# Altium schematic sheet FPGA_14_15.SchDoc: SPEC-A7
size 420 x 297 mm; Author: G.Kasprowicz; CompanyName: WUT ISE; DrawnBy: G.Kasprowicz; Organization: WUT ISE; Address1: PW ISE; Address2: Nowowiejska 15/19 00-665 Warsaw; Address3: gkasprow@gmail.com; Revision: 2; SheetNumber: 3; SheetTotal: 18; ModifiedBy: -; CheckedDate: -; Title2: FPGA 14 &15; DivGrp: WUT ISE; Designer: G.Kasprowicz; ModifiedDate: -; ProjectName: Sensor Box
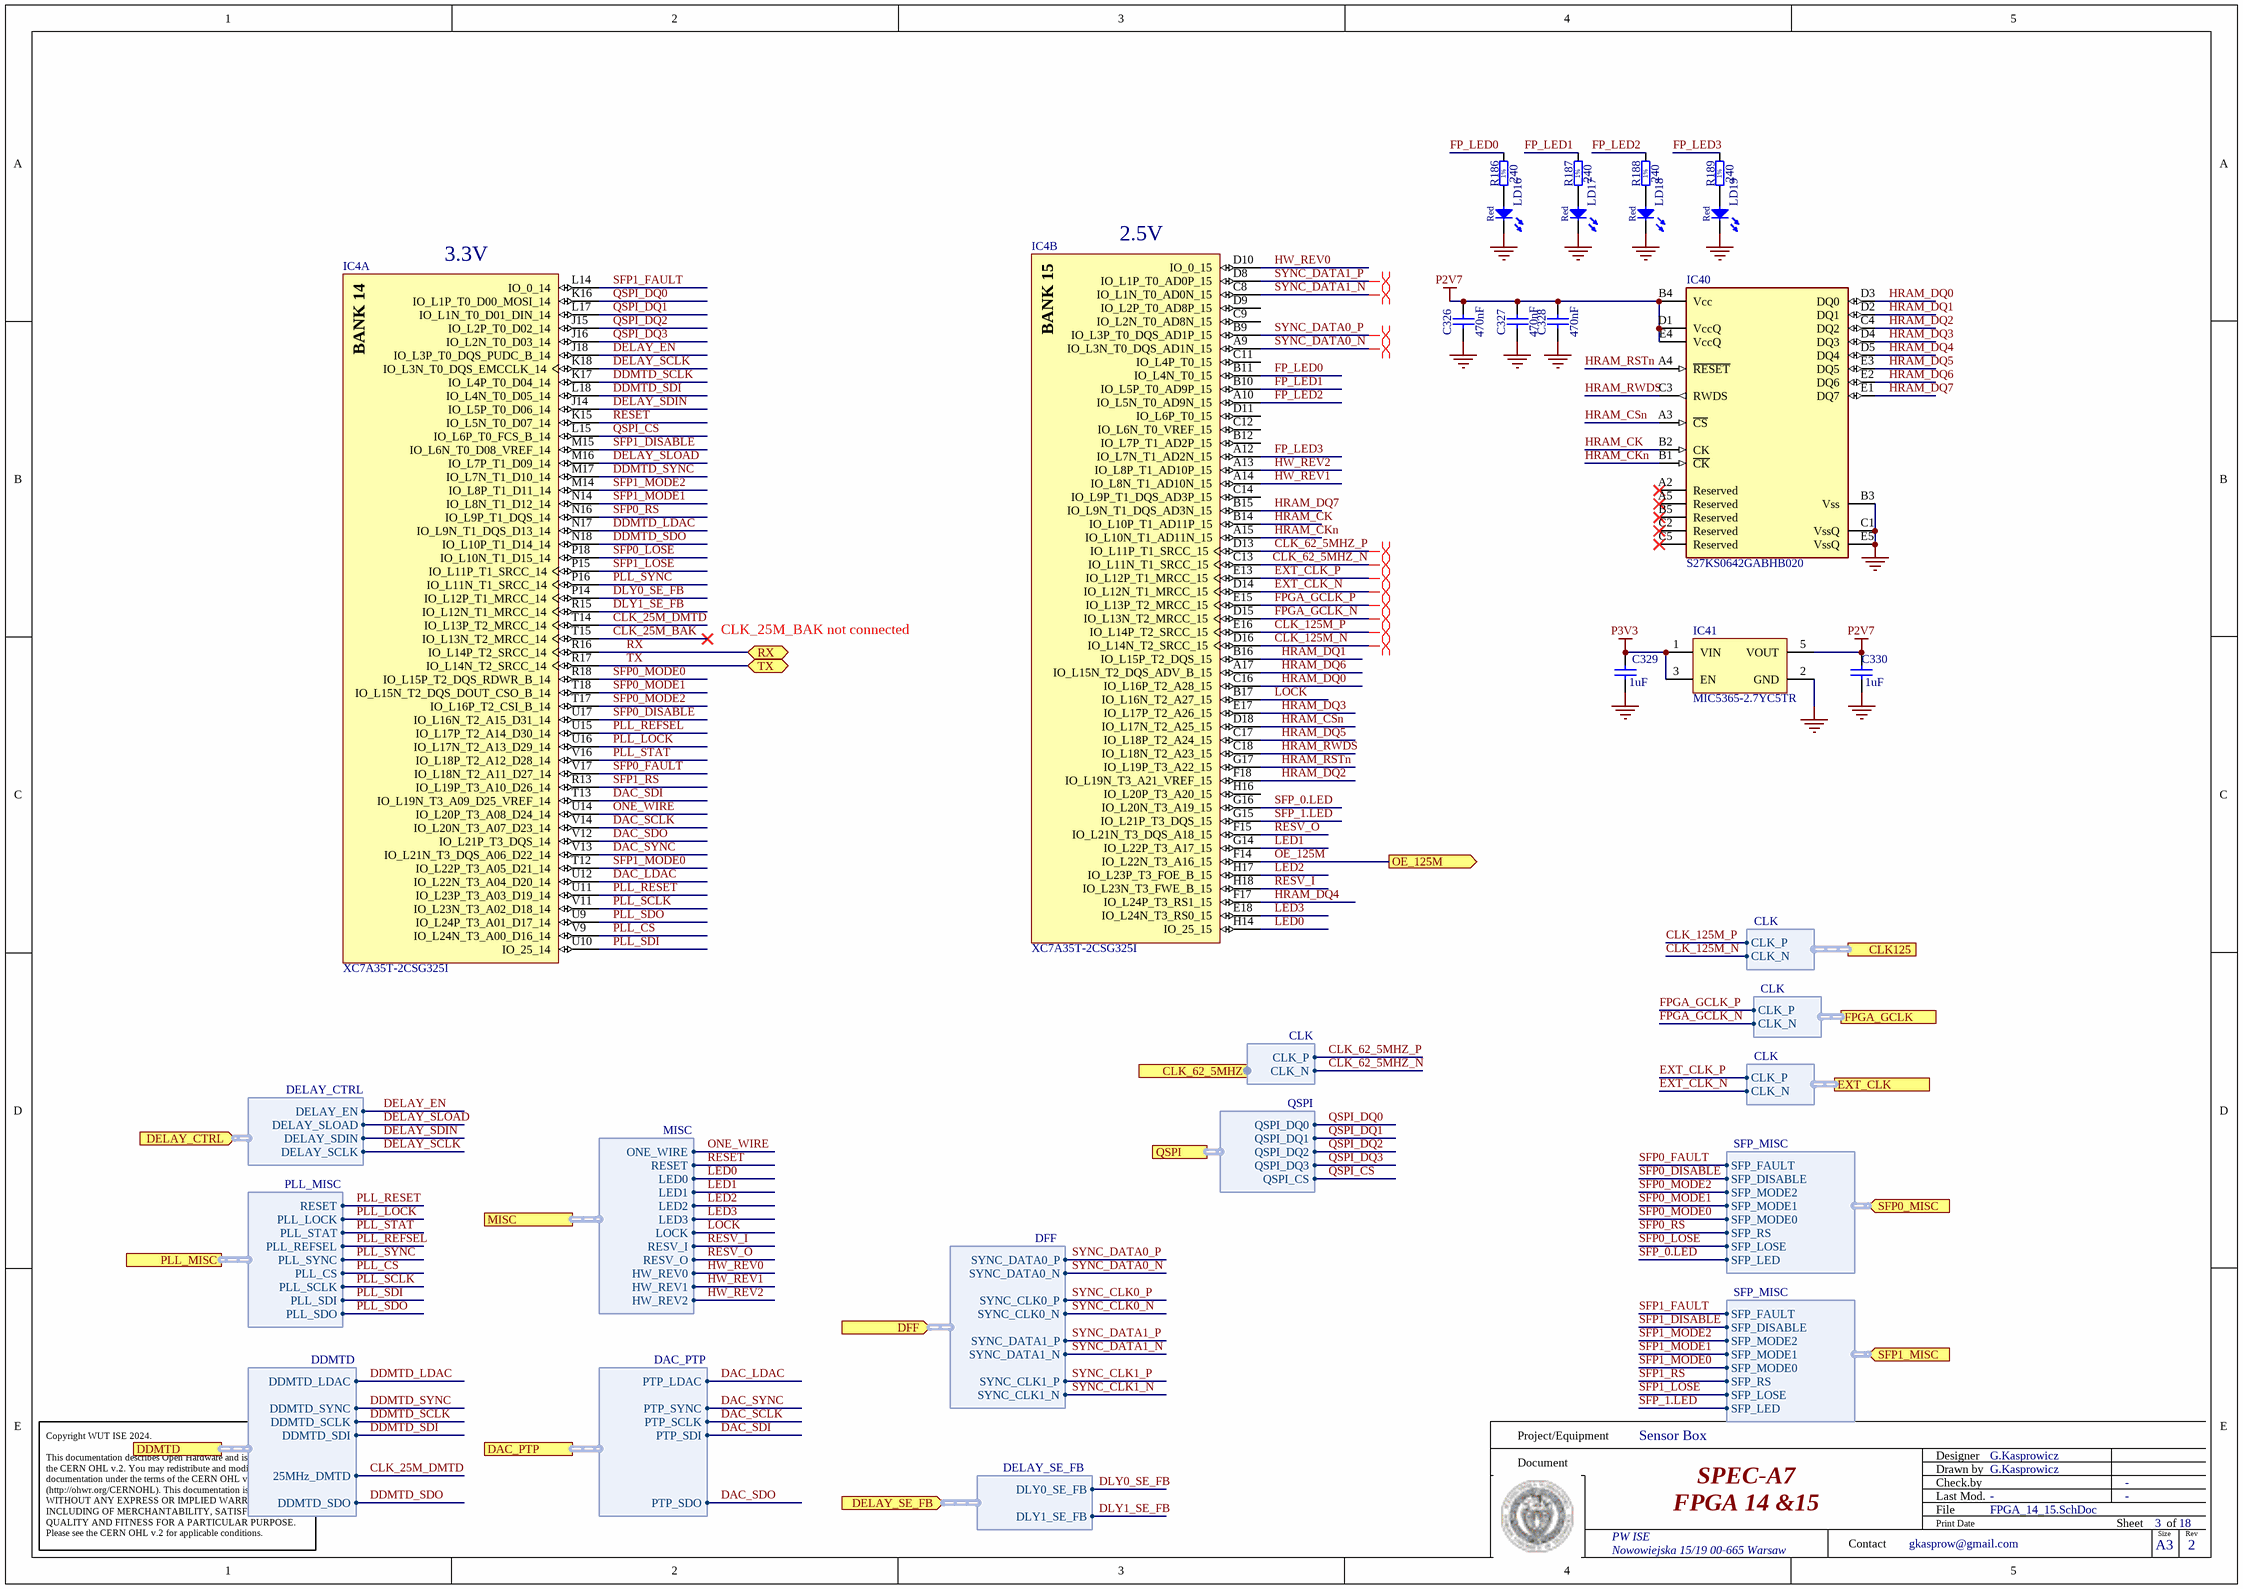
[diagram p0: FPGA_14_15.SchDoc]

## Parts
C326  470nF  [CAPC0603X33N]
C327  470nF  [CAPC0603X33N]
C328  470nF  [CAPC0603X33N]
C329  1uF  [CAPC1005X55N]
C330  1uF  [CAPC1005X55N]
IC4  XC7A35T-2CSG325I  [CSG325]  (parts A,B of 9)
IC40  S27KS0642GABHB020  [FP-PG-BGA-24-IPC_A]
IC41  MIC5365-2.7YC5TR  [SOT65P210X110-5N]
LD16  Red  [LED_AVAGO_HSMC-C120]
LD17  Red  [LED_AVAGO_HSMC-C120]
LD18  Red  [LED_AVAGO_HSMC-C120]
LD19  Red  [LED_AVAGO_HSMC-C120]
R186  240  [RESC1005X40N]
R187  240  [RESC1005X40N]
R188  240  [RESC1005X40N]
R189  240  [RESC1005X40N]

## Ports
CLK125 (harness CLK, see SPEC-A7-TOP[3C], FPGA_MGT[2C]), CLK_62_5MHZ (harness CLK, see SPEC-A7-TOP[3B], Clocks_PLL[5B]), DAC_PTP (harness DAC_PTP, see SPEC-A7-TOP[3C], VCXO_25M_PTP[1C]), DDMTD (harness DDMTD, see SPEC-A7-TOP[3C], VCXO_25M_DDMTD[1D]), DELAY_CTRL (in, harness DELAY_CTRL, see SPEC-A7-TOP[3C], DIFF_DELAY_FANOUT[5B]), DELAY_SE_FB (in, harness DELAY_SE_FB, see SPEC-A7-TOP[3C], DIFF_DELAY_FANOUT[5D]), DFF (in, harness DFF, see SPEC-A7-TOP[3C], Clocks_PLL[3C], DIFF_DELAY_FANOUT[5C]), EXT_CLK (harness CLK, see SPEC-A7-TOP[3B], Clocks_PLL[3B]), FPGA_GCLK (harness CLK, see SPEC-A7-TOP[3B], Clocks_PLL[3B]), MISC (harness MISC, see SPEC-A7-TOP[3C], Misc[2C]), OE_125M (out, see SPEC-A7-TOP[3C], XO_125M[1D]), PLL_MISC (harness PLL_MISC, see SPEC-A7-TOP[3B], Clocks_PLL[5D]), QSPI (harness QSPI, see SPEC-A7-TOP[3C], FPGA_PWR_CONFIG[3E]), RX (bidir, see SPEC-A7-TOP[3C]), SFP0_MISC (in, harness SFP_MISC, see SPEC-A7-TOP[3B], SFP[4B]), SFP1_MISC (in, harness SFP_MISC, see SPEC-A7-TOP[3B], SFP[4C]), TX (bidir, see SPEC-A7-TOP[3C])

## Harnesses
DDMTD: DDMTD_LDAC, DDMTD_SYNC, DDMTD_SCLK, DDMTD_SDI, DDMTD_SDO, 25MHz_DMTD
DAC_PTP: PTP_LDAC, PTP_SYNC, PTP_SCLK, PTP_SDI, PTP_SDO
PLL_MISC: RESET, PLL_LOCK, PLL_STAT, PLL_REFSEL, PLL_SYNC, PLL_CS, PLL_SCLK, PLL_SDI, PLL_SDO
DELAY_CTRL: DELAY_EN, DELAY_SLOAD, DELAY_SDIN, DELAY_SCLK
DFF: SYNC_DATA0_P, SYNC_DATA0_N, SYNC_CLK0_P, SYNC_CLK0_N, SYNC_DATA1_P, SYNC_DATA1_N, SYNC_CLK1_P, SYNC_CLK1_N
DELAY_SE_FB: DLY0_SE_FB, DLY1_SE_FB
MISC: ONE_WIRE, RESET, LED0, LED1, LED2, LED3, LOCK, RESV_I, RESV_O, HW_REV0, HW_REV1, HW_REV2
QSPI: QSPI_DQ0, QSPI_DQ1, QSPI_DQ2, QSPI_DQ3, QSPI_CS
CLK: CLK_P, CLK_N
SFP_MISC: SFP_FAULT, SFP_DISABLE, SFP_MODE2, SFP_MODE1, SFP_MODE0, SFP_RS, SFP_LOSE, SFP_LED

## Nets
GND: C326.1 C327.1 C328.1 C329.1 C330.1 IC40.B3(Vss) IC40.C1(VssQ) IC40.E5(VssQ) IC41.2(GND) LD16.1(C) LD17.1(C) LD18.1(C) LD19.1(C)
P2V7: C326.2 C327.2 C328.2 C330.2 IC40.B4(Vcc) IC40.D1(VccQ) IC40.E4(VccQ) IC41.5(VOUT)
P3V3: C329.2 IC41.1(VIN) IC41.3(EN)
CLK_25M_BAK: IC4.T15(IO_L13N_T2_MRCC_14)
CLK_25M_DMTD: IC4.T14(IO_L13P_T2_MRCC_14) ; port DDMTD.25MHz_DMTD
CLK_62_5MHZ_N: IC4.C13(IO_L11N_T1_SRCC_15) ; port CLK_62_5MHZ.CLK_N
CLK_62_5MHZ_P: IC4.D13(IO_L11P_T1_SRCC_15) ; port CLK_62_5MHZ.CLK_P
CLK_125M_N: IC4.D16(IO_L14N_T2_SRCC_15) ; port CLK125.CLK_N
CLK_125M_P: IC4.E16(IO_L14P_T2_SRCC_15) ; port CLK125.CLK_P
DAC_LDAC: IC4.U12(IO_L22N_T3_A04_D20_14) ; port DAC_PTP.PTP_LDAC
DAC_SCLK: IC4.V14(IO_L20N_T3_A07_D23_14) ; port DAC_PTP.PTP_SCLK
DAC_SDI: IC4.T13(IO_L19N_T3_A09_D25_VREF_14) ; port DAC_PTP.PTP_SDI
DAC_SDO: IC4.V12(IO_L21P_T3_DQS_14) ; port DAC_PTP.PTP_SDO
DAC_SYNC: IC4.V13(IO_L21N_T3_DQS_A06_D22_14) ; port DAC_PTP.PTP_SYNC
DDMTD_LDAC: IC4.N17(IO_L9N_T1_DQS_D13_14) ; port DDMTD.DDMTD_LDAC
DDMTD_SCLK: IC4.K17(IO_L4P_T0_D04_14) ; port DDMTD.DDMTD_SCLK
DDMTD_SDI: IC4.L18(IO_L4N_T0_D05_14) ; port DDMTD.DDMTD_SDI
DDMTD_SDO: IC4.N18(IO_L10P_T1_D14_14) ; port DDMTD.DDMTD_SDO
DDMTD_SYNC: IC4.M17(IO_L7N_T1_D10_14) ; port DDMTD.DDMTD_SYNC
DELAY_EN: IC4.J18(IO_L3P_T0_DQS_PUDC_B_14) ; port DELAY_CTRL.DELAY_EN
DELAY_SCLK: IC4.K18(IO_L3N_T0_DQS_EMCCLK_14) ; port DELAY_CTRL.DELAY_SCLK
DELAY_SDIN: IC4.J14(IO_L5P_T0_D06_14) ; port DELAY_CTRL.DELAY_SDIN
DELAY_SLOAD: IC4.M16(IO_L7P_T1_D09_14) ; port DELAY_CTRL.DELAY_SLOAD
DLY0_SE_FB: IC4.P14(IO_L12P_T1_MRCC_14) ; port DELAY_SE_FB.DLY0_SE_FB
DLY1_SE_FB: IC4.R15(IO_L12N_T1_MRCC_14) ; port DELAY_SE_FB.DLY1_SE_FB
EXT_CLK_N: IC4.D14(IO_L12N_T1_MRCC_15) ; port EXT_CLK.CLK_N
EXT_CLK_P: IC4.E13(IO_L12P_T1_MRCC_15) ; port EXT_CLK.CLK_P
FP_LED0: IC4.B11(IO_L4N_T0_15) R186.2
FP_LED1: IC4.B10(IO_L5P_T0_AD9P_15) R187.2
FP_LED2: IC4.A10(IO_L5N_T0_AD9N_15) R188.2
FP_LED3: IC4.A12(IO_L7N_T1_AD2N_15) R189.2
FPGA_GCLK_N: IC4.D15(IO_L13N_T2_MRCC_15) ; port FPGA_GCLK.CLK_N
FPGA_GCLK_P: IC4.E15(IO_L13P_T2_MRCC_15) ; port FPGA_GCLK.CLK_P
HRAM_CK: IC4.B14(IO_L10P_T1_AD11P_15) IC40.B2(CK)
HRAM_CKn: IC4.A15(IO_L10N_T1_AD11N_15) IC40.B1(~{CK})
HRAM_CSn: IC4.D18(IO_L17N_T2_A25_15) IC40.A3(~{CS})
HRAM_DQ0: IC4.C16(IO_L16P_T2_A28_15) IC40.D3(DQ0)
HRAM_DQ1: IC4.B16(IO_L15P_T2_DQS_15) IC40.D2(DQ1)
HRAM_DQ2: IC4.F18(IO_L19N_T3_A21_VREF_15) IC40.C4(DQ2)
HRAM_DQ3: IC4.E17(IO_L17P_T2_A26_15) IC40.D4(DQ3)
HRAM_DQ4: IC4.F17(IO_L24P_T3_RS1_15) IC40.D5(DQ4)
HRAM_DQ5: IC4.C17(IO_L18P_T2_A24_15) IC40.E3(DQ5)
HRAM_DQ6: IC4.A17(IO_L15N_T2_DQS_ADV_B_15) IC40.E2(DQ6)
HRAM_DQ7: IC4.B15(IO_L9N_T1_DQS_AD3N_15) IC40.E1(DQ7)
HRAM_RSTn: IC4.G17(IO_L19P_T3_A22_15) IC40.A4(~{RESET})
HRAM_RWDS: IC4.C18(IO_L18N_T2_A23_15) IC40.C3(RWDS)
HW_REV0: IC4.D10(IO_0_15) ; port MISC.HW_REV0
HW_REV1: IC4.A14(IO_L8N_T1_AD10N_15) ; port MISC.HW_REV1
HW_REV2: IC4.A13(IO_L8P_T1_AD10P_15) ; port MISC.HW_REV2
LED0: IC4.H14(IO_25_15) ; port MISC.LED0
LED1: IC4.G14(IO_L22P_T3_A17_15) ; port MISC.LED1
LED2: IC4.H17(IO_L23P_T3_FOE_B_15) ; port MISC.LED2
LED3: IC4.E18(IO_L24N_T3_RS0_15) ; port MISC.LED3
LOCK: IC4.B17(IO_L16N_T2_A27_15) ; port MISC.LOCK
OE_125M: IC4.F14(IO_L22N_T3_A16_15) ; port OE_125M
ONE_WIRE: IC4.U14(IO_L20P_T3_A08_D24_14) ; port MISC.ONE_WIRE
PLL_CS: IC4.V9(IO_L24N_T3_A00_D16_14) ; port PLL_MISC.PLL_CS
PLL_LOCK: IC4.U16(IO_L17N_T2_A13_D29_14) ; port PLL_MISC.PLL_LOCK
PLL_REFSEL: IC4.U15(IO_L17P_T2_A14_D30_14) ; port PLL_MISC.PLL_REFSEL
PLL_RESET: IC4.U11(IO_L23P_T3_A03_D19_14) ; port PLL_MISC.RESET
PLL_SCLK: IC4.V11(IO_L23N_T3_A02_D18_14) ; port PLL_MISC.PLL_SCLK
PLL_SDI: IC4.U10(IO_25_14) ; port PLL_MISC.PLL_SDI
PLL_SDO: IC4.U9(IO_L24P_T3_A01_D17_14) ; port PLL_MISC.PLL_SDO
PLL_STAT: IC4.V16(IO_L18P_T2_A12_D28_14) ; port PLL_MISC.PLL_STAT
PLL_SYNC: IC4.P16(IO_L11N_T1_SRCC_14) ; port PLL_MISC.PLL_SYNC
QSPI_CS: IC4.L15(IO_L6P_T0_FCS_B_14) ; port QSPI.QSPI_CS
QSPI_DQ0: IC4.K16(IO_L1P_T0_D00_MOSI_14) ; port QSPI.QSPI_DQ0
QSPI_DQ1: IC4.L17(IO_L1N_T0_D01_DIN_14) ; port QSPI.QSPI_DQ1
QSPI_DQ2: IC4.J15(IO_L2P_T0_D02_14) ; port QSPI.QSPI_DQ2
QSPI_DQ3: IC4.J16(IO_L2N_T0_D03_14) ; port QSPI.QSPI_DQ3
RESET: IC4.K15(IO_L5N_T0_D07_14) ; port MISC.RESET
RESV_I: IC4.H18(IO_L23N_T3_FWE_B_15) ; port MISC.RESV_I
RESV_O: IC4.F15(IO_L21N_T3_DQS_A18_15) ; port MISC.RESV_O
RX: IC4.R16(IO_L14P_T2_SRCC_14) ; port RX
SFP0_DISABLE: IC4.U17(IO_L16N_T2_A15_D31_14) ; port SFP0_MISC.SFP_DISABLE
SFP0_FAULT: IC4.V17(IO_L18N_T2_A11_D27_14) ; port SFP0_MISC.SFP_FAULT
SFP0_LOSE: IC4.P18(IO_L10N_T1_D15_14) ; port SFP0_MISC.SFP_LOSE
SFP0_MODE0: IC4.R18(IO_L15P_T2_DQS_RDWR_B_14) ; port SFP0_MISC.SFP_MODE0
SFP0_MODE1: IC4.T18(IO_L15N_T2_DQS_DOUT_CSO_B_14) ; port SFP0_MISC.SFP_MODE1
SFP0_MODE2: IC4.T17(IO_L16P_T2_CSI_B_14) ; port SFP0_MISC.SFP_MODE2
SFP0_RS: IC4.N16(IO_L9P_T1_DQS_14) ; port SFP0_MISC.SFP_RS
SFP1_DISABLE: IC4.M15(IO_L6N_T0_D08_VREF_14) ; port SFP1_MISC.SFP_DISABLE
SFP1_FAULT: IC4.L14(IO_0_14) ; port SFP1_MISC.SFP_FAULT
SFP1_LOSE: IC4.P15(IO_L11P_T1_SRCC_14) ; port SFP1_MISC.SFP_LOSE
SFP1_MODE0: IC4.T12(IO_L22P_T3_A05_D21_14) ; port SFP1_MISC.SFP_MODE0
SFP1_MODE1: IC4.N14(IO_L8N_T1_D12_14) ; port SFP1_MISC.SFP_MODE1
SFP1_MODE2: IC4.M14(IO_L8P_T1_D11_14) ; port SFP1_MISC.SFP_MODE2
SFP1_RS: IC4.R13(IO_L19P_T3_A10_D26_14) ; port SFP1_MISC.SFP_RS
SFP_0.LED: IC4.G16(IO_L20N_T3_A19_15) ; port SFP0_MISC.SFP_LED
SFP_1.LED: IC4.G15(IO_L21P_T3_DQS_15) ; port SFP1_MISC.SFP_LED
SYNC_CLK0_N: port DFF.SYNC_CLK0_N
SYNC_CLK0_P: port DFF.SYNC_CLK0_P
SYNC_CLK1_N: port DFF.SYNC_CLK1_N
SYNC_CLK1_P: port DFF.SYNC_CLK1_P
SYNC_DATA0_N: IC4.A9(IO_L3N_T0_DQS_AD1N_15) ; port DFF.SYNC_DATA0_N
SYNC_DATA0_P: IC4.B9(IO_L3P_T0_DQS_AD1P_15) ; port DFF.SYNC_DATA0_P
SYNC_DATA1_N: IC4.C8(IO_L1N_T0_AD0N_15) ; port DFF.SYNC_DATA1_N
SYNC_DATA1_P: IC4.D8(IO_L1P_T0_AD0P_15) ; port DFF.SYNC_DATA1_P
TX: IC4.R17(IO_L14N_T2_SRCC_14) ; port TX
NetLD16_2: LD16.2(A) R186.1
NetLD17_2: LD17.2(A) R187.1
NetLD18_2: LD18.2(A) R188.1
NetLD19_2: LD19.2(A) R189.1

Not connected (* = marked no-connect by the designer): IC4 B12(IO_L7P_T1_AD2P_15) C9(IO_L2N_T0_AD8N_15) C11(IO_L4P_T0_15) C12(IO_L6N_T0_VREF_15) C14(IO_L9P_T1_DQS_AD3P_15) D9(IO_L2P_T0_AD8P_15) D11(IO_L6P_T0_15) H16(IO_L20P_T3_A20_15); IC40 A2(Reserved)* A5(Reserved)* B5(Reserved)* C2(Reserved)* C5(Reserved)*

## Layout directives
differential pair: CLK_62_5MHZ_N, CLK_62_5MHZ_P, CLK_125M_N, CLK_125M_P, EXT_CLK_N, EXT_CLK_P, FPGA_GCLK_N, FPGA_GCLK_P, SYNC_DATA0_N, SYNC_DATA0_P, SYNC_DATA1_N, SYNC_DATA1_P

## Notes on the sheet
- 3.3V
- 2.5V
- CLK_25M_BAK not connected
- Project/Equipment
- Document
- Designer
- Drawn by
- Check.by
- Copyright WUT ISE 2024.
  This documentation describes Open Hardware and is licensed under the CERN OHL v.2. You may redistribute and modify this documentation under the terms of the CERN OHL v.2. (http://ohwr.org/CERNOHL). This documentation is distributed WITHOUT ANY EXPRESS OR IMPLIED WARRANTY, INCLUDING OF MERCHANTABILITY, SATISFACTORY QUALITY AND FITNESS FOR A PARTICULAR PURPOSE. Please see the CERN OHL v.2 for applicable conditions.
- Contact
- File
- Last Mod.
- Print Date
- Sheet
- Size
- A3
- of
- Rev
- (in symbol CMP-0383-00003-1, part A) BANK 14
- (in symbol CMP-0383-00003-1, part B) BANK 15
- (in symbol R0402_240R_1%_0.0625W_100PPM) 1%

## Library data of the parts
C326-C328 = CC0201_470NF_4V_20%_X5R: Non-polarised capacitor; Part Description: SMD Multilayer Chip Ceramic Capacitor; Manufacturer: GENERIC; Manufacturer1 Part Number: AMK063BJ474MP-F; Voltage: 4V; TC: X5R; Tolerance: ±20%; Part Number: CC0201_470NF_4V_20%_X5R; Component Kind: Standard; Component Type: Standard; Pin Count: 2; Value: 470nF; Status: Not Recommended; Manufacturer Part Number: CC0201_470NF_4V_20%_X5R; Case: 0201; Mounted: Yes; Socket: No; SMD: Yes; Sense: No; Manufacturer1 Example: TAIYO YUDEN; Manufacturer1 ComponentHeight: 0.33mm; HelpURL: \\cern.ch\dfs\Applications\Altium\Datasheets\CC0201_X5R_TAIYO-YUDEN_STANDARD-CLASS2.pdf; Author: CERN DEM JLC; CreateDate: 27.05.2010; LatestRevisionDate: 27.05.2010
C329 C330 = CC0402_1UF_16V_10%_X5R: Non-polarised capacitor; Part Description: SMD Multilayer Chip Ceramic Capacitor; Manufacturer: GENERIC; Manufacturer1 Part Number: C1005X5R1C105KT; Voltage: 16V; TC: X5R; Tolerance: ±10%; Part Number: CC0402_1UF_16V_10%_X5R; Component Kind: Standard; Component Type: Standard; Pin Count: 2; Value: 1uF; Status: Preferred; Manufacturer Part Number: CC0402_1UF_16V_10%_X5R; Case: 0402; Mounted: Yes; Socket: No; SMD: Yes; Sense: No; Manufacturer1 Example: TDK; Manufacturer1 ComponentHeight: 0.55mm; HelpURL: \\cern.ch\dfs\Applications\Altium\Datasheets\CC0402_X5R_TDK_C.pdf; Author: CERN DEM JLC; CreateDate: 25.10.2012; LatestRevisionDate: 25.10.2012
IC4 = CMP-0383-00003-1: Artix-7 FPGA, 150 User I/Os, 4 GTP, 324-Ball BGA, Speed Grade 2, Industrial Grade, Pb-Free; Manufacturer: Xilinx; Available User I/O: 150; Speed Grades: 2; GTP: 4; Logic Cells: 33280; Total Block RAM: 1800 Kb; CMTs: 5; ComponentLink3URL: http://www.xilinx.com/support/documentation/user_guides/ug475_7Series_Pkg_Pinout.pdf; Maximum Distributed RAM: 400 Kb; Operating Temperature Range: Industrial; ComponentLink1URL: http://www.xilinx.com/; Mounting Technology: Surface Mount; ComponentLink1Description: Manufacturer URL; ComponentLink2Description: Datasheet; PartNumber: XC7A35T-2CSG325I; PackageVersion: Rev. 1.11; PackageDescription: 324-Ball Wire-Bond Chip-Scale BGA, Body 15 x 15 mm, Pitch 0.8 mm; DatasheetVersion: Rev. 1.15; PackageReference: CSG-325; ComponentLink3Description: Pinout; ComponentLink4Description: Package Specification; ComponentLink2URL: http://www.xilinx.com/support/documentation/data_sheets/ds180_7Series_Overview.pdf; ComponentLink4URL: http://www.xilinx.com/support/documentation/user_guides/ug475_7Series_Pkg_Pinout.pdf
IC40 = CMP-32844-000028-1: IC PSRAM 64MBIT HYPERBUS 24FBGA
LD16-LD19 = LED_AVAGO_HSMC-C120: LED Red 1C 2A; Part Description: High Performance Right Angle Chip Red LED; Manufacturer: AVAGO TECHNOLOGIES; PressFit: No; Bonding: No; Part Number: LED_AVAGO_HSMC-C120; Component Kind: Standard; Component Type: Standard; Color: Red; PackageDescription: Red Chip LED, 2-Leads, Body 1.7x1.1mm, Side Emitting Package; Manufacturer Part Number: HSMC-C120; Pin Count: 2; Mounted: Yes; Socket: No; SMD: Yes; Sense: No; ComponentHeight: 0.7mm; HelpURL: \\cern.ch\dfs\Applications\Altium\Datasheets\LED_AVAGO_HSMC-C120.pdf; ComponentLink1URL: \\cern.ch\dfs\Applications\Altium\Datasheets\LED_AVAGO_HSMC-C120_DESIGN-GUIDE.pdf; ComponentLink1Description: Design Guide; Author: CERN DEM JMW; CreateDate: 22.07.2009; LatestRevisionDate: 20.06.2012
R186-R189 = R0402_240R_1%_0.0625W_100PPM: Resistor - 1%; Part Description: General Purpose Thick Film Chip Resistor; Manufacturer: GENERIC; Manufacturer1 Part Number: 232270672401L; TC: ±100ppm/°C; PressFit: No; Part Number: R0402_240R_1%_0.0625W_100PPM; Component Kind: Standard; Component Type: Standard; Pin Count: 2; Value: 240; Status: Not Recommended; Power: 0.0625W; Tolerance: ±1%; Manufacturer Part Number: R0402_240R_1%_0.0625W_100PPM; Case: 0402; Mounted: Yes; Sense: No; Socket: No; SMD: Yes; Manufacturer1 Example: YAGEO PHYCOMP; Manufacturer1 ComponentHeight: 0.4mm; HelpURL: \\cern.ch\dfs\Applications\Altium\Datasheets\R0402_Phycomp_RC0402.pdf; Author: CERN DEM JLC; CreateDate: 03.12.2007; LatestRevisionDate: 17.10.2012